# Altium schematic sheet [0]Top.SchDoc
size A4
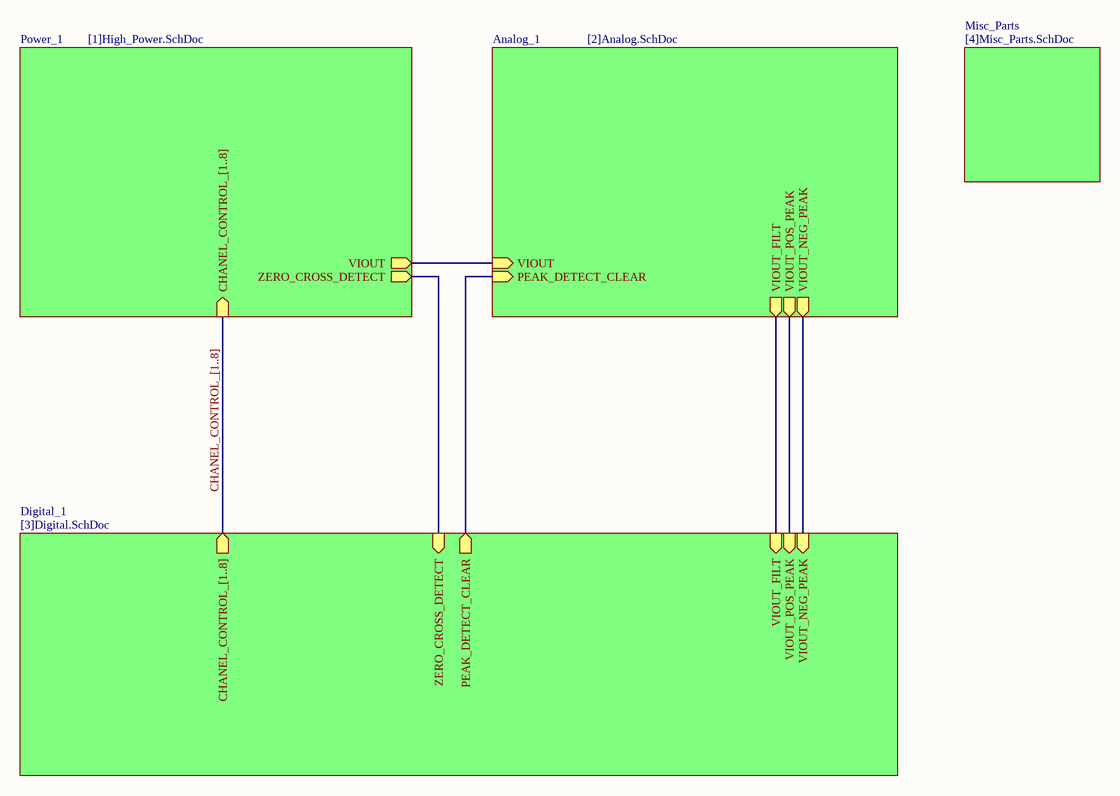
[diagram p0: [0]Top.SchDoc]

## Sub-sheets
Analog_1 = [2]Analog.SchDoc: VIOUT (in), VIOUT_FILT (out), VIOUT_NEG_PEAK (out), PEAK_DETECT_CLEAR (in), VIOUT_POS_PEAK (out)
Digital_1 = [3]Digital.SchDoc: ZERO_CROSS_DETECT (in), VIOUT_FILT (in), VIOUT_NEG_PEAK (in), VIOUT_POS_PEAK (in), PEAK_DETECT_CLEAR (out), CHANEL_CONTROL_[1..8] (out)
Misc_Parts = [4]Misc_Parts.SchDoc: no entries
Power_1 = [1]High_Power.SchDoc: VIOUT (out), ZERO_CROSS_DETECT (out), CHANEL_CONTROL_[1..8] (in)

## Nets
(unnamed): sheet Power_1/VIOUT, sheet Analog_1/VIOUT
(unnamed): sheet Power_1/ZERO_CROSS_DETECT, sheet Digital_1/ZERO_CROSS_DETECT
(unnamed): sheet Analog_1/VIOUT_FILT, sheet Digital_1/VIOUT_FILT
(unnamed): sheet Analog_1/VIOUT_NEG_PEAK, sheet Digital_1/VIOUT_NEG_PEAK
(unnamed): sheet Analog_1/PEAK_DETECT_CLEAR, sheet Digital_1/PEAK_DETECT_CLEAR
(unnamed): sheet Analog_1/VIOUT_POS_PEAK, sheet Digital_1/VIOUT_POS_PEAK

## Buses and harness runs
bus CHANEL_CONTROL_[1..8] = sheet Digital_1/CHANEL_CONTROL_[1..8] = sheet Power_1/CHANEL_CONTROL_[1..8]